# EAGLE design old_line_kick (EAGLE 7.7.0)
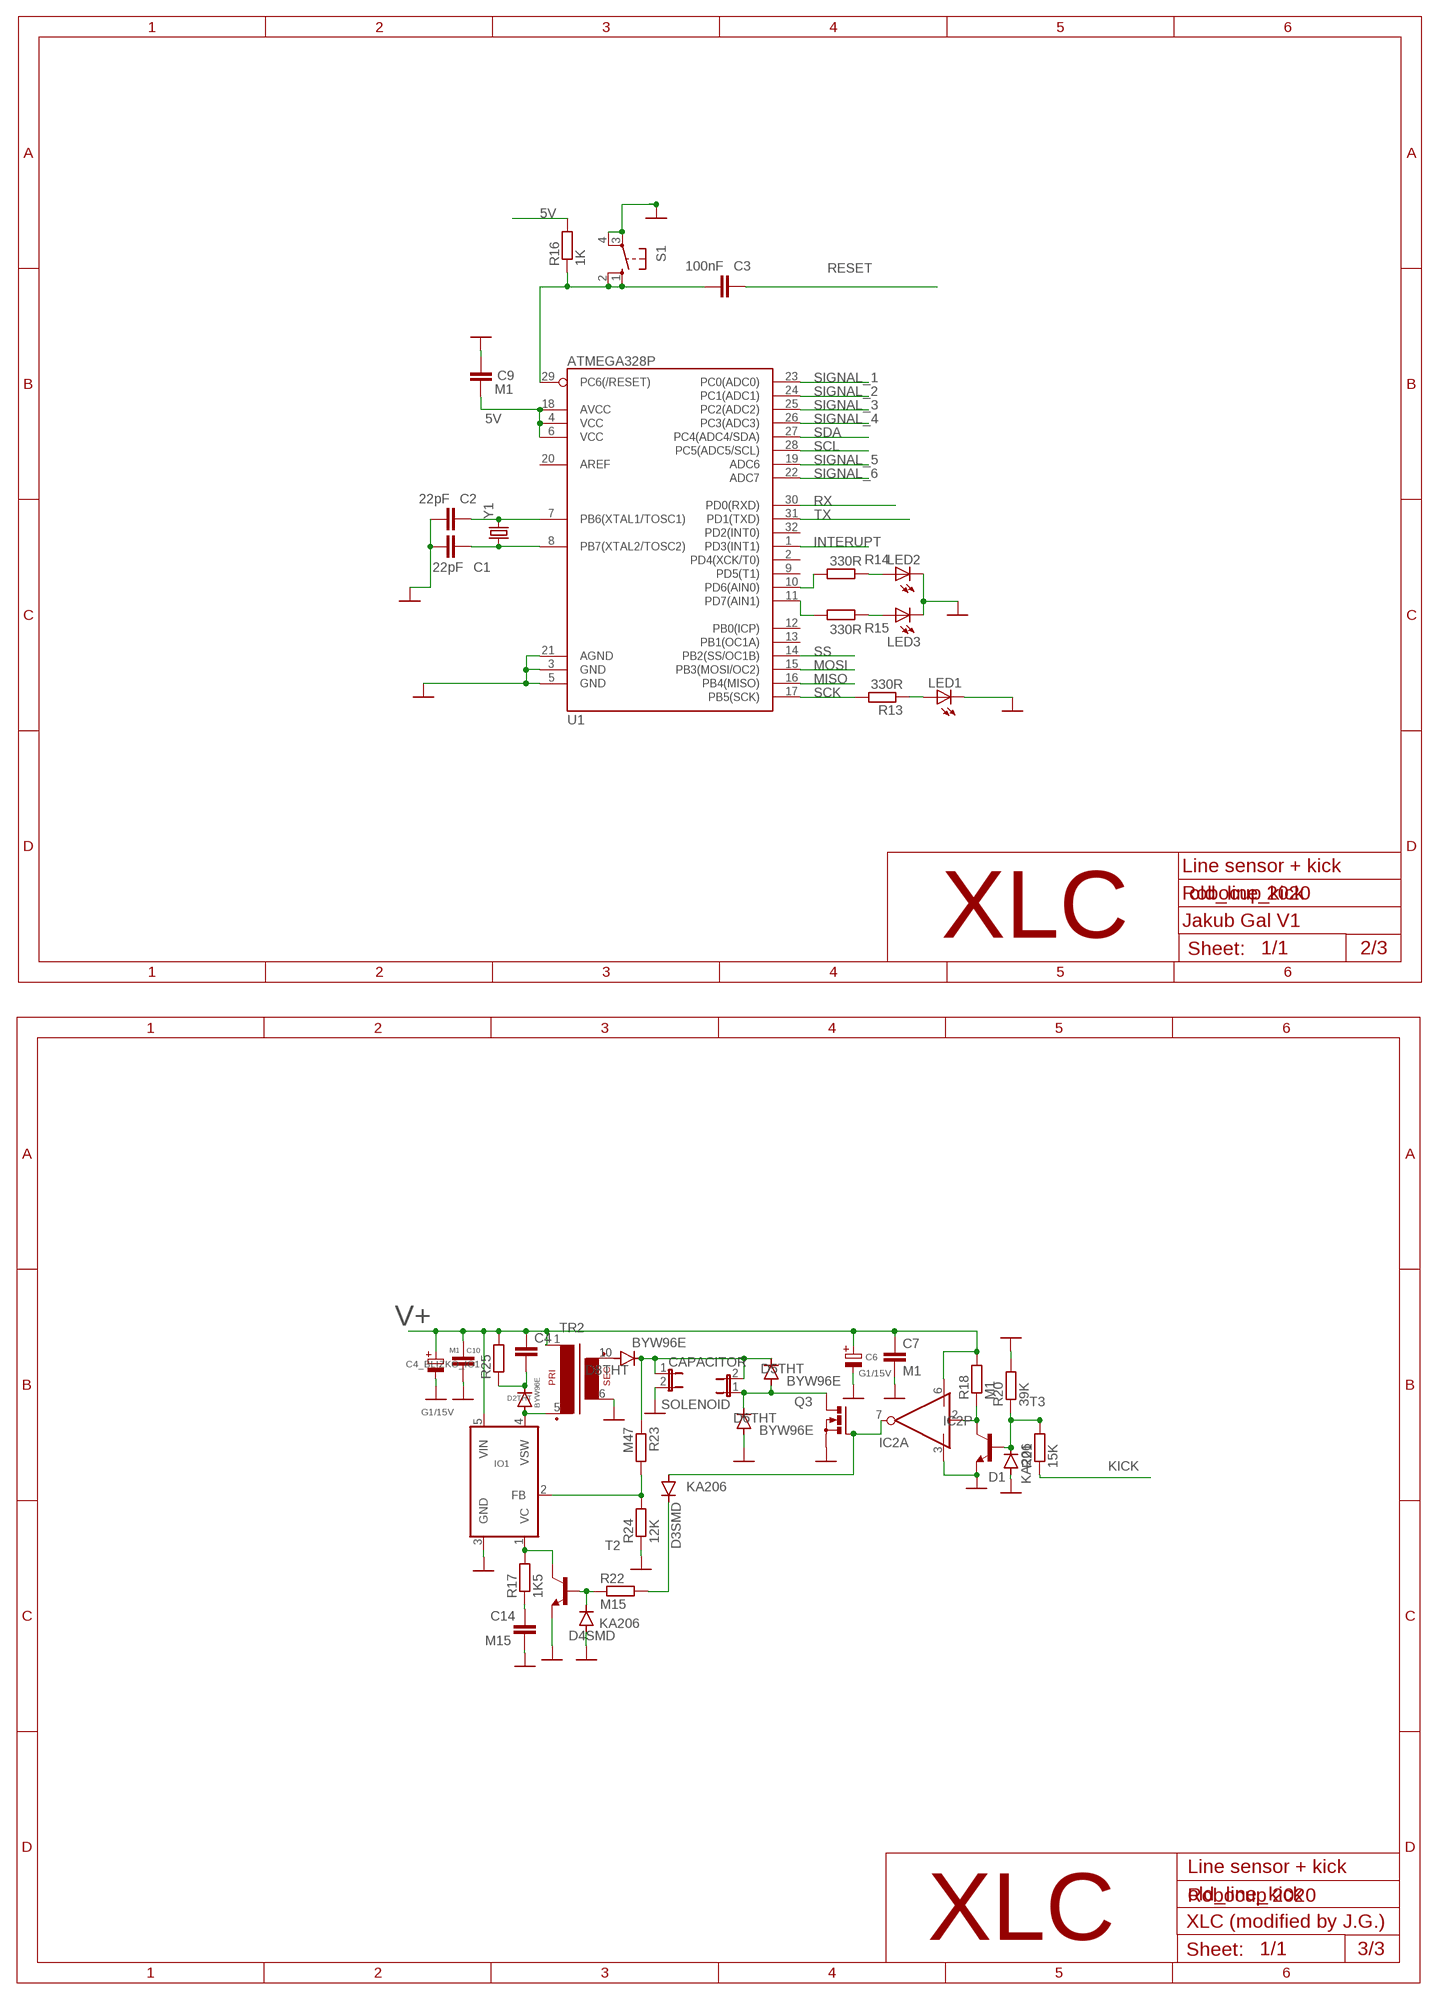
[diagram p0: schematic, sheet 1, part 1 of 2]
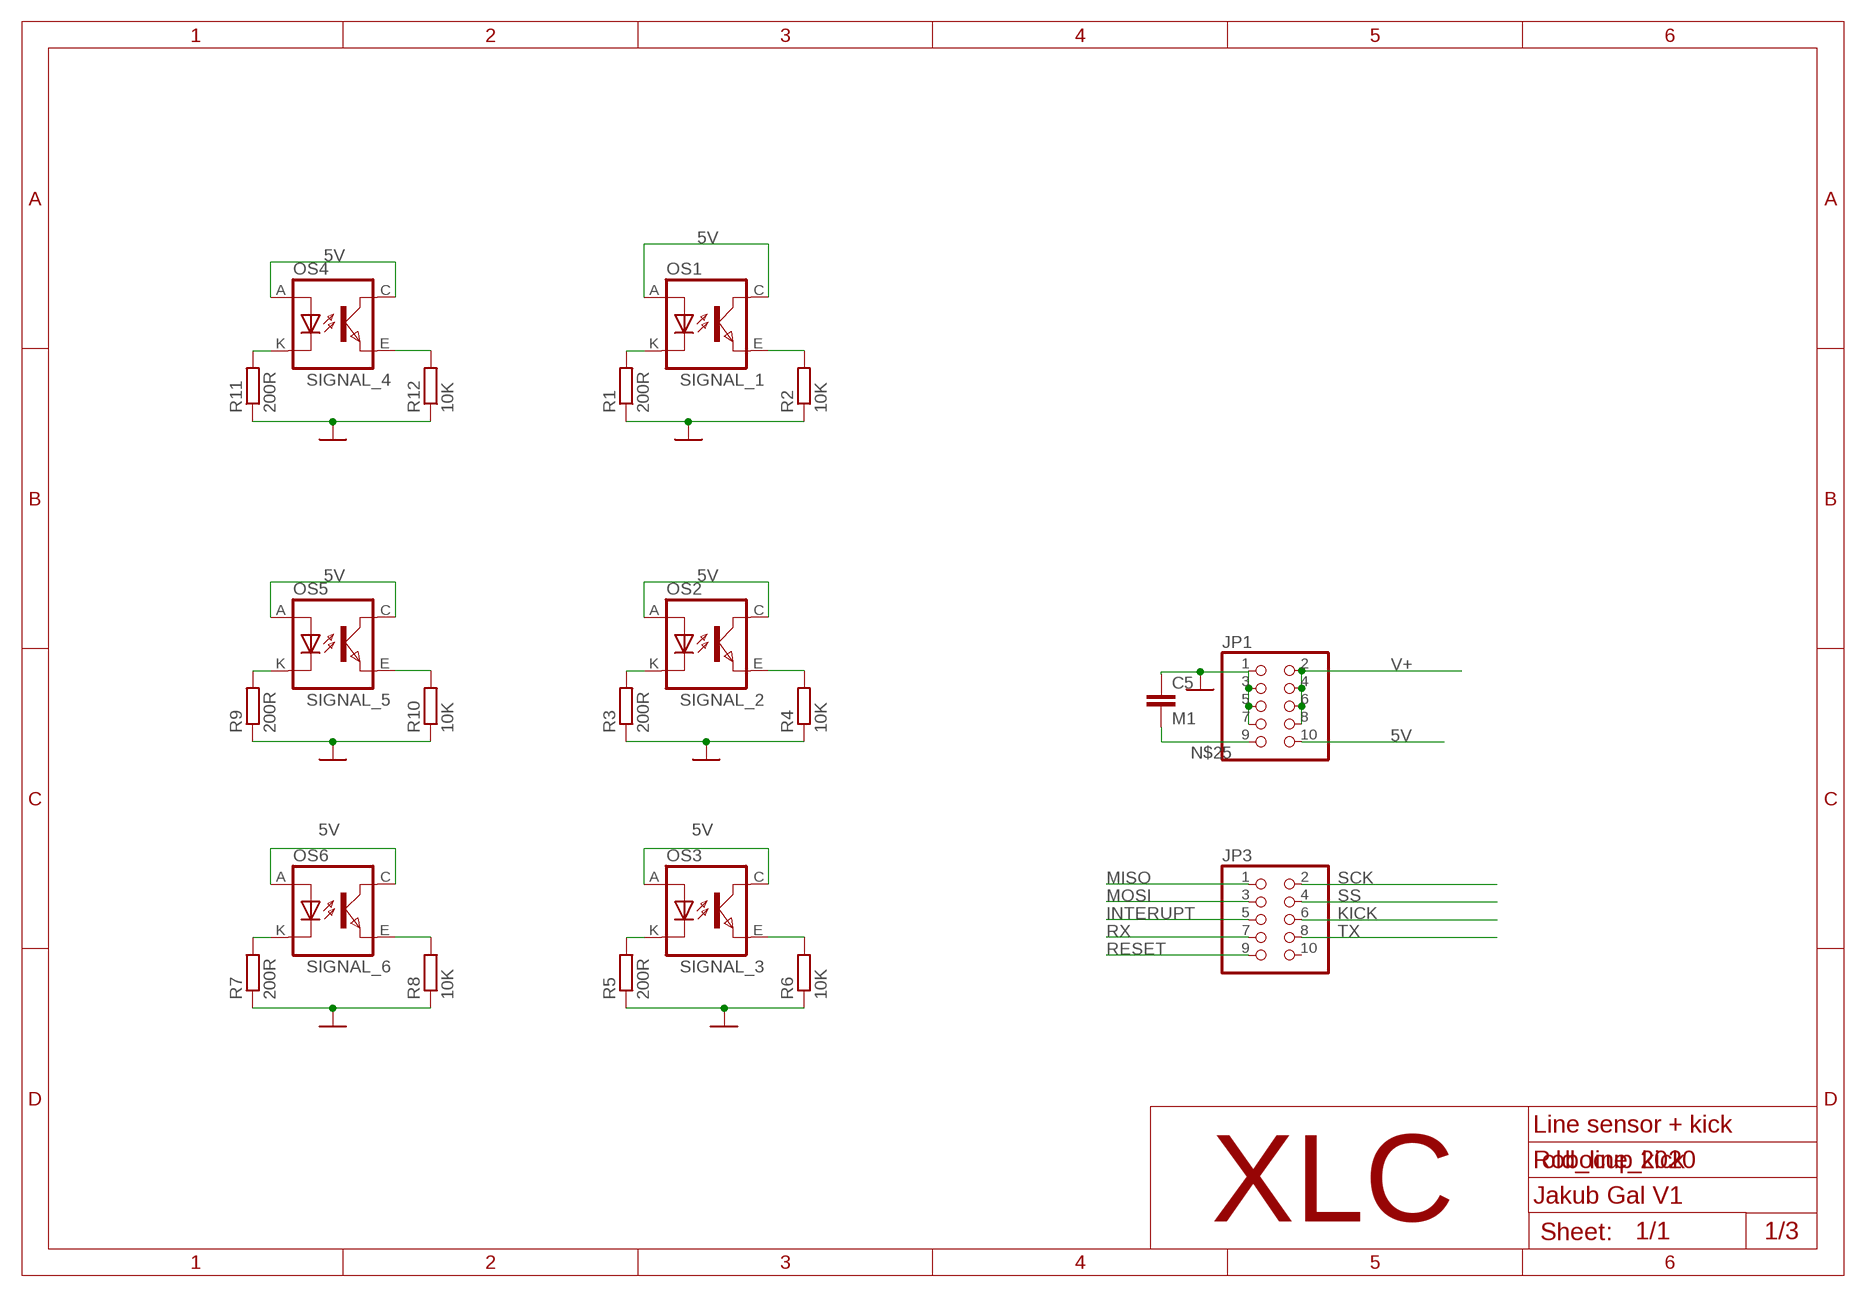
[diagram p1: schematic, sheet 1, part 2 of 2]

## Parts
C1  22pF  C-EUC0603  [C0603]
C2  22pF  C-EUC0603  [C0603]
C3  100nF  C-EUC0603  [C0603]
C4  C-EU075-052X106  [C075-052X106]
C4_BLIZKO_IO1  G1/15V  KOND-ELEKT-2,5/7  [E-2,5/7-RAD]
C5  M1  C-EUC0603  [C0603]
C6  G1/15V  KOND-ELEKT-2,5/7  [E-2,5/7-RAD]
C7  M1  C-EUC0805K  [C0805K]
C9  M1  C-EUC0603  [C0603]
C10  M1  C-EUC0805K  [C0805K]
C14  M15  C-EUC0805K  [C0805K]
CAPACITOR  JP1E  [JP1]
D1  KA206  DIODE-D-7.5  [D-7.5]
D2THT  BYW96E  BYW96  [SOD64-10]
D3SMD  KA206  DIODE-D-7.5  [D-7.5]
D4SMD  KA206  DIODE-D-7.5  [D-7.5]
D5THT  BYW96E  BYW96  [SOD64-10]
D6THT  BYW96E  BYW96  [SOD64-10]
D8THT  BYW96E  BYW96  [SOD64-10]
IC2  MIC4423BM  [SO08]
IO1  LT1071V  [TO220-5P]
JP1  PINHD-2X5IDC  [2X05_IDC]
JP3  PINHD-2X5IDC  [2X05_IDC]
LED1  LEDCHIPLED_0603  [CHIPLED_0603]
LED2  LEDCHIPLED_0603  [CHIPLED_0603]
LED3  LEDCHIPLED_0603  [CHIPLED_0603]
OS1  TCRT5000  [TCRT5000]
OS2  TCRT5000  [TCRT5000]
OS3  TCRT5000  [TCRT5000]
OS4  TCRT5000  [TCRT5000]
OS5  TCRT5000  [TCRT5000]
OS6  TCRT5000  [TCRT5000]
Q3  PMOSFET_NTO220BV  [TO220BV]
R1  200R  R-EU_R0603  [R0603]
R2  10K  R-EU_R0603  [R0603]
R3  200R  R-EU_R0603  [R0603]
R4  10K  R-EU_R0603  [R0603]
R5  200R  R-EU_R0603  [R0603]
R6  10K  R-EU_R0603  [R0603]
R7  200R  R-EU_R0603  [R0603]
R8  10K  R-EU_R0603  [R0603]
R9  200R  R-EU_R0603  [R0603]
R10  10K  R-EU_R0603  [R0603]
R11  200R  R-EU_R0603  [R0603]
R12  10K  R-EU_R0603  [R0603]
R13  330R  R-EU_R0603  [R0603]
R14  330R  R-EU_R0603  [R0603]
R15  330R  R-EU_R0603  [R0603]
R16  1K  R-EU_R0603  [R0603]
R17  1K5  R-EU_R1206  [R1206]
R18  M1  R-EU_R1206  [R1206]
R20  39K  R-EU_R1206  [R1206]
R21  15K  R-EU_R1206  [R1206]
R22  M15  R-EU_R1206  [R1206]
R23  M47  R-EU_R1206  [R1206]
R24  12K  R-EU_R1206  [R1206]
R25  REZISTOR-7,5MM-HORIZ  [R-7,5H]
S1  10-XX  [B3F-10XX]
SOLENOID  JP1E  [JP1]
T2  -NPN-SC59-BEC  [SC59-BEC]
T3  -NPN-SC59-BEC  [SC59-BEC]
TR2  TRAFO-E10-R""  [TRAFO-EE17X20]
U1  ATMEGA328P  ATMEGA328_SMT  [TQFP32-08]
Y1  CRYSTALHC49US  [HC49US]

## Nets
5V: C9.1 JP1.10 OS1.A(ANODE) OS1.C(COLLECTOR) OS2.A(ANODE) OS2.C(COLLECTOR) OS3.A(ANODE) OS3.C(COLLECTOR) OS4.A(ANODE) OS4.C(COLLECTOR) OS5.A(ANODE) OS5.C(COLLECTOR) OS6.A(ANODE) OS6.C(COLLECTOR) R16.2 U1.4(VCC) U1.6(VCC) U1.18(AVCC)
GND: C1.1 C2.1 C4_BLIZKO_IO1.- C5.1 C6.- C7.2 C9.2 C10.2 C14.2 CAPACITOR.2 D1.A D4SMD.A D6THT.A IC2.3(P:GND) IO1.3(GND) JP1.1 JP1.3 JP1.5 JP1.7 LED1.C LED2.C LED3.C Q3.S R1.1 R2.1 R3.1 R4.1 R5.1 R6.1 R7.1 R8.1 R9.1 R10.1 R11.1 R12.1 R20.2 R24.1 S1.3(P) S1.4(P1) T2.E T3.E TR2.6 U1.3(GND) U1.5(GND) U1.21(AGND)
INTERUPT: JP3.5 U1.1(PD3(INT1))
KICK: JP3.6 R21.1
MISO: JP3.1 U1.16(PB4(MISO))
MOSI: JP3.3 U1.15(PB3(MOSI/OC2))
N$1: OS1.K(CATHODE) R1.2
N$2: OS2.K(CATHODE) R3.2
N$3: OS3.K(CATHODE) R5.2
N$4: OS6.K(CATHODE) R7.2
N$5: OS5.K(CATHODE) R9.2
N$6: OS4.K(CATHODE) R11.2
N$7: C2.2 U1.7(PB6(XTAL1/TOSC1)) Y1.2
N$8: C1.2 U1.8(PB7(XTAL2/TOSC2)) Y1.1
N$9: IO1.1(VC) R17.2 T2.C
N$10: C14.1 R17.1
N$11: D8THT.A TR2.10
N$12: D3SMD.A IC2.7(A:OUT) Q3.G
N$13: CAPACITOR.1 D5THT.C D8THT.C R23.1 SOLENOID.2
N$14: IO1.2(FB) R23.2 R24.2
N$15: D4SMD.C R22.1 T2.B
N$16: C3.1 R16.1 S1.1(S) S1.2(S1) U1.29(PC6(/RESET))
N$17: LED1.A R13.1
N$18: IC2.2(A:IN) R18.1 T3.C
N$19: LED2.A R14.1
N$20: R15.2 U1.11(PD7(AIN1))
N$21: LED3.A R15.1
N$22: R14.2 U1.10(PD6(AIN0))
N$23: D2THT.A IO1.4(VSW) TR2.5
N$24: C4.2 D2THT.C R25.1
N$25: C5.2 JP1.9
N$26: D5THT.A D6THT.C Q3.D SOLENOID.1
N$29: D3SMD.C R22.2
N$31: D1.C R20.1 R21.2 T3.B
RESET: C3.2 JP3.9
RX: JP3.7 U1.30(PD0(RXD))
SCK: JP3.2 R13.2 U1.17(PB5(SCK))
SCL: U1.28(PC5(ADC5/SCL))
SDA: U1.27(PC4(ADC4/SDA))
SIGNAL_1: OS1.E(EMITTER) R2.2 U1.23(PC0(ADC0))
SIGNAL_2: OS2.E(EMITTER) R4.2 U1.24(PC1(ADC1))
SIGNAL_3: OS3.E(EMITTER) R6.2 U1.25(PC2(ADC2))
SIGNAL_4: OS4.E(EMITTER) R12.2 U1.26(PC3(ADC3))
SIGNAL_5: OS5.E(EMITTER) R10.2 U1.19(ADC6)
SIGNAL_6: OS6.E(EMITTER) R8.2 U1.22(ADC7)
SS: JP3.4 U1.14(PB2(SS/OC1B))
TX: JP3.8 U1.31(PD1(TXD))
V+: C4.1 C4_BLIZKO_IO1.+ C6.+ C7.1 C10.1 IC2.6(P:V+) IO1.5(VIN) JP1.2 JP1.4 JP1.6 JP1.8 R18.2 R25.2 TR2.1
Unconnected: IC2.4(B:IN) IC2.5(B:OUT) JP3.10 U1.2(PD4(XCK/T0)) U1.9(PD5(T1)) U1.12(PB0(ICP)) U1.13(PB1(OC1A)) U1.20(AREF) U1.32(PD2(INT0))

## Notes on the sheet
- Line sensor + kick
- Robocup 2020
- Jakub Gal V1
- XLC
- 2/3
- Line sensor + kick
- Robocup 2020
- XLC (modified by J.G.)
- XLC
- 3/3
- Line sensor + kick
- Robocup 2020
- Jakub Gal V1
- XLC
- 1/3

## Library data of the parts
C1-C3 C9 = rcl@1:C-EU: CAPACITOR, European symbol
C4 C5 = rcl:C-EU: CAPACITOR, European symbol; SPICEPREFIX: C
C4_BLIZKO_IO1 C6 = TABOR K1:KOND-ELEKT: Kondenzátor elektrolyticky
C7 C10 C14 = resistor:C-EU: CAPACITOR, European symbol
CAPACITOR SOLENOID = jumper:JP1E: JUMPER
D1 D3SMD D4SMD = diode:DIODE-: DIODE
D2THT D5THT D6THT D8THT = diode:BYW96: DIODE fast soft-recovery rectifier
IC2 = TABOR K1:MIC4423B: 2x Invertor driver MOSFET
IO1 = TABOR K1:LT1071: DC/DC pulzny IO
JP1 JP3 = pinhead-1:PINHD-2X5: PIN HEADER
LED1-LED3 = audio amplifier example:LED
OS1-OS3 OS5 = tcrt5000:TCRT5000
OS4 OS6 = tcrt5000:TCRT5000; SPICEPREFIX: O
Q3 = transistor-power:PMOSFET_N: Power MOSFET N-Channel
R1-R18 R20-R24 = rcl:R-EU_: RESISTOR, European symbol; SPICEPREFIX: R
R25 = TABOR K1:REZISTOR: REZISTOR
S1 = switch-omron:10-XX: OMRON SWITCH; MPN: B3F-1000; OC_FARNELL: 176432; OC_NEWARK: 36M3542
T2 T3 = DC_LOAD_AU:*-NPN-: NPN Transistror BF959 corrected 2008.03.06
TR2 = TABOR K1:TRAFO-E10-R: Transformátor s feritovym jadrom EE17x20: 1x primár, 1x sekundár
U1 = SparkFun-DigitalIC:ATMEGA328_SMT: 32-Pin Atmega328 part Commonly used on Arduino compatible boards Available in QFP and QFN packages TQFP is IC-09069 QFN is non-stock; PROD_ID: IC-09069
Y1 = SparkFun-FreqCtrl:CRYSTAL: Various standard crystals. Proven footprints. Spark Fun Electronics SKU : COM-00534

## Board
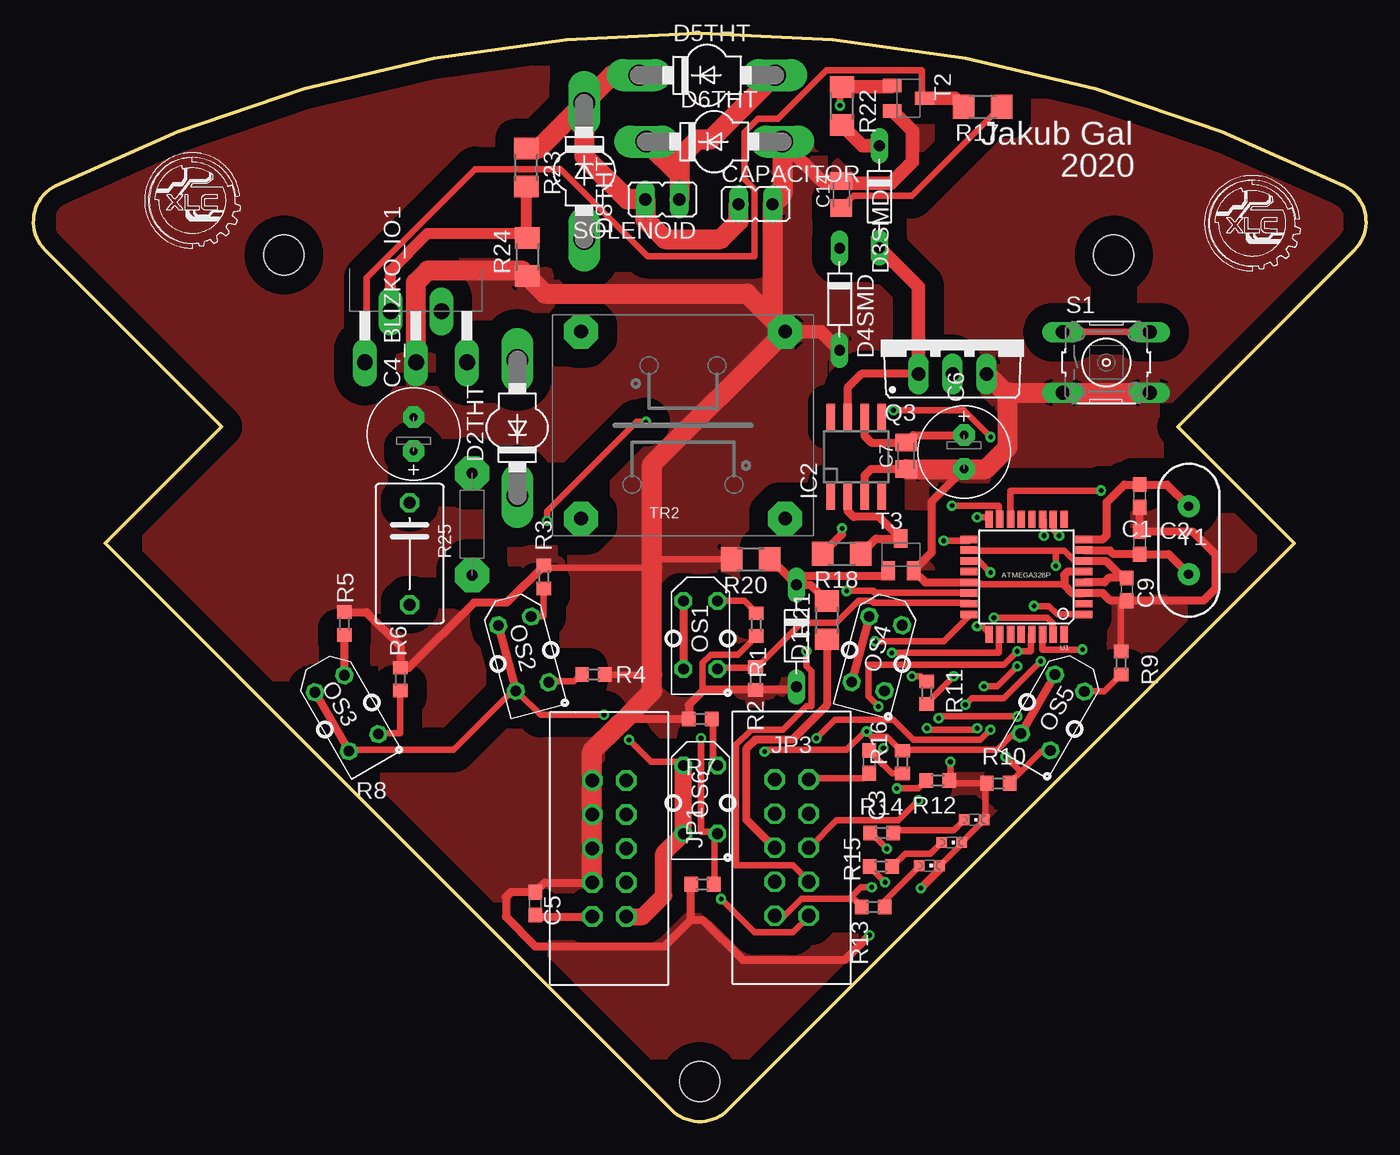
[diagram p2: board, top side]
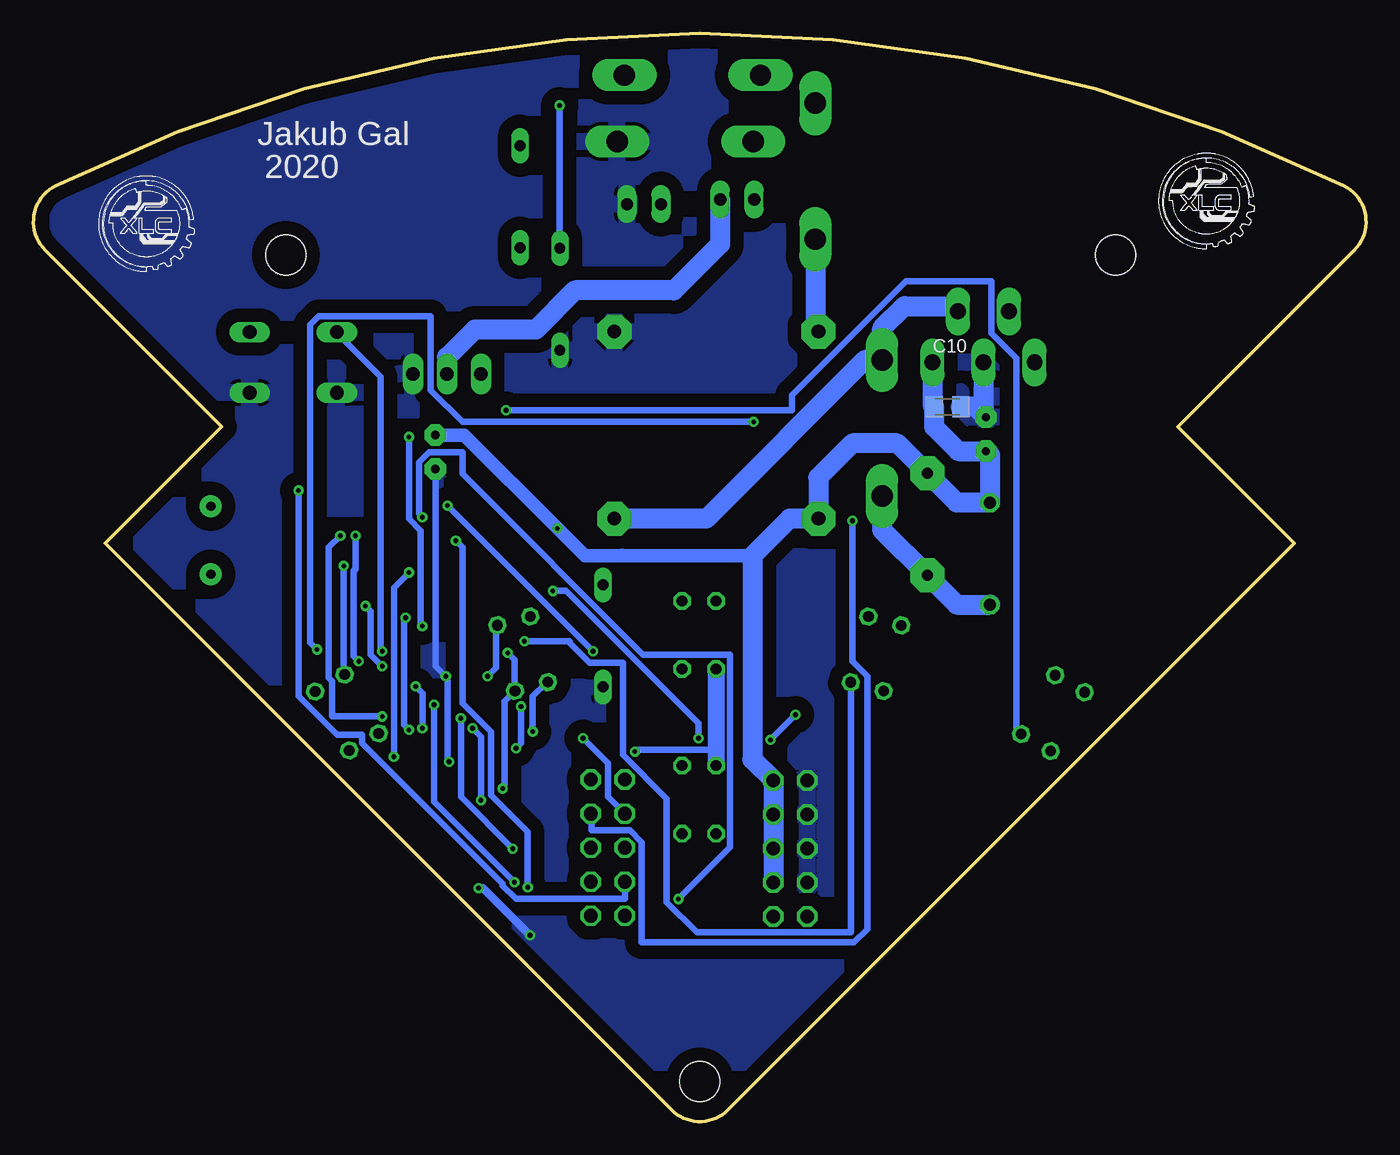
[diagram p3: board, bottom side, seen from below]

Size 99.55 x 81.25 mm. Coordinates in mm from the lower left corner, seen from the top.
Outline: 85.49,51.89 98.67,65.08 arc108 97.9,69.88 arc53 1.66,69.88 arc108 0.88,65.08 14.07,51.89 5.35,43.18 47.66,0.87 arc90 51.9,0.87 94.2,43.18 85.49,51.89
Copper layers (1*16): Top 0.035mm / dielectric 1.5mm / Bottom 0.035mm
Design rules "default *": minimum track width 0.5mm, minimum drill 0.35mm, track to track 6mil, track to pad 6mil, pad to pad 6mil, via to via 6mil, smd to smd 6mil, copper to edge 40mil, drill to drill 6mil, minimum pad ring 10mil, minimum via ring 8mil, stop-mask expansion 4mil, vias tented up to drill 0mil, thermal gap 10mil
Holes 3 mm at 49.78,3 18.71,64.71 80.71,64.71

### Footprints (pad centres in the part's own frame; a part is rotated, then mirrored left to right if it is on the bottom)
C0603 = smd 1.1 x 1: 1 -0.85,0; 2 0.85,0
C075-052X106 = drill 0.914 octagon: 1 -3.81,0; 2 3.81,0
E-2,5/7-RAD = drill 0.61 pad 1.6 octagon: + -1.27,0; - 1.27,0
C0805K = smd 1.3 x 1.6: 1 -1,0; 2 1,0
JP1 = drill 0.914 long: 1 0,-1.27; 2 0,1.27
D-7.5 = drill 0.813 long: A 3.81,0; C -3.81,0
SOD64-10 = drill 1.6 long: A 5.08,0; C -5.08,0
SO08 = smd 0.61 x 1.981: 1 -1.905,-2.972; 2 -0.635,-2.972; 3 0.635,-2.972; 4 1.905,-2.972; 5 1.905,2.972; 6 0.635,2.972; 7 -0.635,2.972; 8 -1.905,2.972
TO220-5P = drill 1.194 pad 1.676 long: 1 -3.81,0; 2 -1.905,3.81; 3 0,0; 4 1.905,3.81; 5 3.81,0
2X05_IDC = drill 1.016 octagon: 1 -5.08,-1.27; 2 -5.08,1.27; 3 -2.54,-1.27; 4 -2.54,1.27; 5 0,-1.27; 6 0,1.27; 7 2.54,-1.27; 8 2.54,1.27; 9 5.08,-1.27; 10 5.08,1.27
CHIPLED_0603 = smd 0.8 x 0.8: A 0,-0.75; C 0,0.75
TCRT5000 = drill 0.8 octagon: A -2.54,-1.27; C 2.54,-1.27; E 2.54,1.27; K -2.54,1.27
TO220BV = drill 1.016 long: D 0,-2.54; G -2.54,-2.54; S 2.54,-2.54
R0603 = smd 1 x 1.1: 1 -0.85,0; 2 0.85,0
R1206 = smd 1.6 x 1.803: 1 -1.422,0; 2 1.422,0
R-7,5H = drill 0.813 pad 2.54 octagon: 1 -3.81,0; 2 3.81,0
B3F-10XX = drill 1.016 long: 1 -3.251,2.261; 2 3.251,2.261; 3 -3.251,-2.261; 4 3.251,-2.261
SC59-BEC = smd 1 x 1.4: B -0.95,-1.2; C 0,1.2; E 0.95,-1.2
TRAFO-EE17X20 = drill 1.016 pad 2.54 octagon: 1 -7.62,-7.62; 5 7.62,-7.62; 6 7.62,6.35; 10 -7.62,6.35
TQFP32-08 = smd 1.27 x 0.559: 1 -4.293,2.8; 2 -4.293,2; 3 -4.293,1.2; 4 -4.293,0.4; 5 -4.293,-0.4; 6 -4.293,-1.2; 7 -4.293,-2; 8 -4.293,-2.8; 17 4.293,-2.8; 18 4.293,-2; 19 4.293,-1.2; 20 4.293,-0.4; 21 4.293,0.4; 22 4.293,1.2; 23 4.293,2; 24 4.293,2.8 | smd 0.559 x 1.27: 9 -2.8,-4.293; 10 -2,-4.293; 11 -1.2,-4.293; 12 -0.4,-4.293; 13 0.4,-4.293; 14 1.2,-4.293; 15 2,-4.293; 16 2.8,-4.293; 25 2.8,4.293; 26 2,4.293; 27 1.2,4.293; 28 0.4,4.293; 29 -0.4,4.293; 30 -1.2,4.293; 31 -2,4.293; 32 -2.8,4.293
HC49US = drill 0.7 pad 1.651: 1 -2.54,0; 2 2.54,0

### Placement (x,y rotation side)
C1  82.63,46.72 90 top
C2  82.63,43.22 270 top
C3  62.44,26.86 270 top
C4  28.1,42.41 270 top
C4_BLIZKO_IO1  28.4,51.34 90 top
C5  37.48,16.28 270 top
C6  69.53,50 270 top
C7  65.19,49.72 270 top
C9  81.68,39.75 270 top
C10  31.27,53.38 0 bottom
C14  60.36,69.23 90 top
CAPACITOR  53.95,68.51 270 top
D1  57.01,36.27 270 top
D2THT  36.15,51.8 90 top
D3SMD  63.2,69.07 270 top
D4SMD  60.23,61.41 270 top
D5THT  50.32,78.14 0 top
D6THT  50.86,73.19 0 top
D8THT  41.14,70.97 270 top
IC2  61.46,49.66 0 top
IO1  28.57,56.69 0 top
JP1  43.01,20.39 270 top
JP3  56.64,20.45 90 top
LED1  66.93,19.11 270 top
LED2  70.28,22.54 270 top
LED3  68.6,20.84 270 top
OS1  49.83,36.34 270 top
OS2  36.61,34.93 285 top
OS3  23.4,30.5 300 top
OS4  63.01,34.94 255 top
OS5  76.13,30.54 240 top
OS6  49.83,24.04 270 top
Q3  68.66,58.37 0 top
R1  54,37.11 90 top
R2  53.94,33.09 90 top
R3  38.13,40.67 270 top
R4  41.83,33.38 180 top
R5  23.23,37.19 270 top
R6  27.42,33.04 270 top
R7  49.82,30.06 0 top
R8  49.98,17.72 0 top
R9  81.25,34.24 270 top
R10  72.08,25.26 0 top
R11  66.74,32.02 90 top
R12  67.55,25.47 180 top
R13  62.73,16.02 180 top
R14  63.37,21.54 180 top
R15  63.31,19.04 180 top
R16  64.92,26.84 90 top
R17  70.91,75.78 180 top
R18  60.38,42.4 180 top
R20  53.58,41.99 180 top
R21  59.27,37.44 90 top
R22  60.4,75.84 270 top
R23  36.82,71.24 270 top
R24  36.89,64.57 90 top
R25  32.77,44.6 90 top
S1  80.15,56.69 0 top
SOLENOID  46.98,68.86 90 top
T2  65.36,76.42 270 top
T3  64.8,42.34 0 top
TR2  48.53,52.65 0 top
U1  74.19,40.67 180 top
Y1  86.31,43.41 270 top

### Tracks (layer width: path | path; a pad name or v marks a point on that pad's centre or on a via)
5V  (via drill 0.35)
  Top 0.5: OS3.C 23.75,27.75 31.37,27.75 35.75,32.12 OS2.C 36.25,32 37.87,30.37 v42.62,30.37 | v44.5,28.5 46.12,26.87 48,26.87 OS6.A | 76.37,42.62 77,42.62 77.75,41.87 78.25,41.87 U1.6 | 76.37,42.62 70,42.62 U1.18 | OS5.C 73.5,28.87 73.12,28.87 72,27.75 65,27.75 R16.2 64.75,27.75 63.75,28.75 62.62,28.75 v62.25,29.12 62.12,29 62,29 60.75,27.75 54.75,27.75 v54.62,27.62 | v76.37,41.5 76.37,42.62
  Top 0.61: U1.4 80.01,40.27 80.34,40.6 C9.1 81.38,40.6 80.11,41.87 U1.6 | OS3.A OS3.C | OS2.A OS2.C | OS1.A OS1.C | OS4.A OS4.C | OS5.A OS5.C
  Top 1.27: JP1.10 45.51,15.31 47.08,16.88 47.08,20.02 OS6.C OS6.A
  Bottom 0.5: v44.5,28.5 v42.62,30.37 | v76.37,41.5 76.37,33.5 OS5.A | v62.25,29.12 62.25,31.75 61.25,32.75 OS4.C | 48.56,27.75 54.62,27.75 v54.62,27.62
  Bottom 1.27: OS1.C 48.56,27.75 OS6.A
GND  (via drill 0.35)
  Top 0.5: LED1.C 67.75,19.12 69.37,20.75 LED3.C 69.5,21 71,22.5 LED2.C 71.12,22.75 71.12,25.25 R10.1 70.87,25.25 68.62,25.25 68.5,25.37 R12.1 68.5,25.62 v68.5,26.87 | R9.1 81.25,38.62 C9.2 | 46.22,33.37 42.75,33.37 R4.1 | R1.1 52.62,34.87 50.62,34.87 50,34.25 50,32.5 50.09,32.24 | v68.75,33.25 66.75,31.25 R11.1 | 46.22,42 52.12,42 R20.2 | 77,40.06 76.75,40.12 70.75,40.12 70.62,40.25 70.12,40.25 U1.21 | 46.22,41.37 38.37,41.37 R3.1
  Top 0.61: C7.2 62.58,48.72 62.09,48.23 IC2.3 | D1.A 56.79,32.24 R2.1 50.09,32.24 48.97,31.12 R7.1 44.14,30.06 43.73,29.65 | C6.- 67.12,46.32 67.12,42.51 T3.E 66.62,40.27 U1.21 | U1.5 77.25,41.07 77,40.82 77,40.06 77.59,39.47 U1.3 79.9,39.47 80.47,38.9 C9.2 87.41,38.9 88.29,39.78 88.29,42.35 86.57,44.07 C2.1 C1.1 | R5.1 24.87,38.04 27.42,35.49 R6.1 28.04,33.89 32.9,38.75 35.36,38.75 R3.1 | JP1.7 38.2,17.85 C5.1 36.12,17.13 35.65,17.13 35.29,16.77 35.29,15.29 37.49,13.09 47.16,13.09 49.13,15.06 | 49.13,15.06 R8.1 | 49.13,15.06 50,15.06 52.99,12.07 60.61,12.07 v62.45,13.91 | v66.3,17.43 67.75,18.88 67.75,19.12
  Top 0.813: 28.52,56.74 IO1.3
  Top 1.016: TR2.6 58.83,59 D4SMD.A | T2.E 65.65,73.98 65.65,71.68 64.05,70.08 60.51,70.08 C14.2 58.9,70.23 D6THT.A
  Top 1.5: JP1.7 JP1.5 JP1.3 JP1.1 41.74,27.66 43.73,29.65 46.22,32.14 46.22,33.37 46.22,41.37 46.22,42 46.22,49.07 TR2.6 | TR2.6 53.32,61.83 38.21,61.83 R24.1 36.49,63.54 29.45,63.54 28.56,62.65 28.56,56.77 28.52,56.74 | TR2.6 55.22,59.93 CAPACITOR.2 55.94,69.23 D6THT.A | C7.2 C6.- 71.15,48.73 72.79,50.37 72.79,54.24 | 72.79,54.24 Q3.S | 72.79,54.24 72.98,54.43 S1.3 S1.4
  Bottom 0.5: C6.- 69.5,48.62 69.5,34 v68.75,33.25 68.62,33.12 68.62,27 v68.5,26.87
  Bottom 0.61: v62.45,13.91 65.97,17.43 v66.3,17.43
  Bottom 1.5: IO1.3 28.57,52.78 C4_BLIZKO_IO1.- 29.17,53.38 C10.2
  pour Bottom (isolate 1): -9,-8.79 108,-8.79 108,83.3 -9,83.3
  pour Top (isolate 1.422): -10,80 -10,-10 110,-10 110,80 110,90 -10,90
INTERUPT  (via drill 0.35)
  Top 0.5: v74.75,38.5 75.87,38.5 76.5,37.87 78.37,37.87 U1.1 | v73.5,34 72,32.5 v71,32.5 | v70.5,29.37 70.37,29.25 66.87,29.25 v66.75,29.37 | v66.12,24 64.62,22.5 60,22.5 58,20.5 JP3.5
  Bottom 0.5: v74.75,38.5 74.37,38.12 74.37,34.87 v73.5,34 | v71,32.5 70.5,32 v70.5,29.37 | v66.75,29.37 66.12,28.75 v66.12,24
KICK
  Top 0.61: R21.1 59.27,31.09 56.7,28.52 53.94,28.52 53.25,27.83 53.25,22.57 JP3.6
MISO  (via drill 0.35)
  Top 0.5: v70.5,45.12 71.25,45.12 71.37,45 U1.16 | v51.37,16.62 53.87,14.12 56.75,14.12 57.87,15.25 JP3.1
  Bottom 0.5: v70.5,45.12 70.75,45.37 70.75,49.25 70,50 67.5,50 67.5,48.37 54,34.87 47.5,34.87 47.5,20.5 v51.37,16.62
MOSI  (via drill 0.35)
  Top 0.5: v68.62,46 72.12,46 72.12,45 U1.15 | v57.75,35.12 57.75,34 58.12,33.62 58.12,31 57.75,31 56,29.25 53.62,29.25 52.5,28.12 52.5,19.12 56.75,19.12 57.87,18 JP3.3
  Bottom 0.5: v57.75,35.12 v68.62,46
N$1
  Top 0.5: R1.2 54,38 53.12,38.87 51.12,38.87 OS1.K
N$2
  Top 0.5: R3.2 38.12,39.75 38.12,37.75 37.25,37.75 OS2.K
N$3
  Top 0.61: OS3.K R5.2 | R5.2
N$4
  Top 0.5: R7.2 50.75,30 50.75,26.62 51,26.62 OS6.K
N$5
  Top 0.5: R9.2 81.25,33.37 80,32.12 78.62,32.12 OS5.K
N$6  (via drill 0.35)
  Top 0.5: v65.62,33.25 66.25,33.25 66.62,32.87 R11.2
  Bottom 0.5: v65.62,33.25 65,33.87 65,37 OS4.K
N$7
  Top 0.61: U1.7 78.52,42.63 80.42,42.63 80.69,42.37 C2.2 84.81,42.37 Y1.2
N$8
  Top 0.61: U1.8 79.88,43.47 80.18,43.77 80.18,46.26 81.49,47.57 C1.2 84.69,47.57 Y1.1
N$9
  Top 0.5: T2.C 66.37,76.87 66.37,78.5 59.25,78.5 55.62,74.87 54.12,74.87 53.12,73.87 53.12,70.37 53.87,69.62 53.87,64.62 45.87,64.62 39.37,71.12 33,71.12 24.87,63 24.87,56.75 IO1.1
  Top 1.016: T2.C 68.85,76.42 R17.2
N$10
  Top 0.5: C14.1 60.37,68.25 61.25,69.12 65.62,69.12 72.25,75.75 R17.1
N$11
  Bottom 1.5: D8THT.A 41.14,59.23 TR2.10
N$12
  Top 0.61: Q3.G 61.86,55.83 60.82,54.79 IC2.7
  Top 1.016: Q3.G 66.12,62.34 D3SMD.A
N$13
  Top 1.5: D8THT.C 37.75,72.66 R23.1 | D8THT.C 41.14,72.09 44.37,68.86 SOLENOID.2 45.71,67.36 47.17,65.9 51.34,65.9 52.68,67.24 CAPACITOR.1 | D8THT.C 43.23,78.14 D5THT.C
N$14
  Top 0.813: IO1.2 26.66,63.54 29.44,66.32 36.56,66.32 R24.2 36.82,66.06 R23.2
N$15  (via drill 0.35)
  Top 0.5: v60.25,75.87 60.25,76.87 R22.1
  Top 1.016: R22.1 64.05,77.26 T2.B
  Bottom 0.5: v60.25,75.87 60.25,65.25 D4SMD.C
N$16  (via drill 0.35)
  Top 0.5: 62.87,27.25 64.12,26 64.87,26 R16.1 | 62.87,27.25 62.5,27.62 C3.1 | U1.29 74.5,36.37 74.5,35.12 v73.5,35.12 72.5,34.12 62.37,34.12 62.37,31.75 v63.12,31 | v63.5,27.87 62.87,27.25 | S1.2 83.37,59 77,59 S1.1
  Bottom 0.5: v73.5,35.12 73.62,35.25 73.62,55.62 76.87,58.87 S1.1 | v63.5,27.87 63.12,28.25 v63.12,31
N$17
  Top 0.5: LED1.A 66.12,19 63.58,16.45 R13.1
N$18
  Top 0.61: IC2.2 60.82,45.59 61.26,45.15 63.18,45.15 T3.C 62.94,43.54 R18.1
N$19
  Top 0.5: LED2.A 69.5,22.5 68.75,21.75 64.37,21.75 64.25,21.62 R14.1
N$20  (via drill 0.35)
  Top 0.5: v63.62,17.87 R15.2 | v69.62,31.12 70.12,31.62 72.5,31.62 v75.25,34.37 | v75.5,43.75 75.5,44.87 U1.11
  Bottom 0.5: v63.62,17.87 69.62,23.87 v69.62,31.12 | v75.25,34.37 75.62,34.75 75.62,41.12 75.5,41.25 v75.5,43.75
N$21
  Top 0.5: LED3.A 67.75,20.75 67,20 65.12,20 64.25,19.12 R15.1
N$22  (via drill 0.35)
  Top 0.5: v63.75,20.37 62.62,21.5 R14.2 | v67.62,30.12 67.75,30.25 v73.5,30.25 | v76.62,43.75 76.25,44.12 76.25,44.87 U1.10
  Bottom 0.5: v63.75,20.37 67.62,24.25 v67.62,30.12 | v73.5,30.25 77.25,30.25 77.25,32.87 77.5,33.12 77.5,42.87 v76.62,43.75
N$23
  Bottom 1.5: IO1.4 30.87,60.9 34.48,60.9 36.15,59.23 D2THT.A 37.43,56.88 49.28,45.03 TR2.5
N$24
  Bottom 1.5: D2THT.C 36.15,44.17 R25.1 30.58,38.6 C4.2
N$25
  Top 0.61: C5.2 37.6,15.31 JP1.9
N$26
  Top 1.5: D5THT.A 50.59,73.33 49.62,73.33 48.25,71.96 SOLENOID.1 48.25,70.72 D6THT.C
  Bottom 1.5: SOLENOID.1 48.25,65.53 51.71,62.07 59.1,62.07 62.02,59.15 66.59,59.15 68.66,57.08 Q3.D
N$29
  Top 1.016: R22.2 61.94,72.88 D3SMD.C
N$31
  Top 0.61: D1.C 57.66,40.73 63.44,40.73 T3.B | D1.C 58.05,40.08 R21.2 | R20.1 55.1,41.99 D1.C
RESET
  Top 0.5: C3.2 62.37,26 62,25.62 58,25.62 JP3.9
RX  (via drill 0.35)
  Top 0.5: v78.37,35.25 75.37,35.25 75.37,36.37 U1.30 | v45.75,52.25 45.05,52.25 38.37,45.57 v38.37,44.87
  Bottom 0.5: v78.37,35.25 78.87,35.75 78.87,59.5 78.25,60.12 69.87,60.12 69.87,54.62 67.5,52.25 v45.75,52.25 | v38.37,44.87 38.37,34.37 37.25,33.25 37.25,14.37 38.25,13.37 54.12,13.37 54.12,20.87 55,21.75 57.87,21.75 57.87,22.87 JP3.7
SCK  (via drill 0.35)
  Top 0.5: JP3.2 56.12,15.37 57.37,16.62 61.3,16.62 R13.2 61.1,16.79 61.8,17.5 v62.62,17.5 | v68,43.37 69.87,43.37 U1.17
  Bottom 0.5: v68,43.37 67.5,42.87 67.5,31.25 65.37,29.12 65.37,24.37 62.62,21.62 v62.62,17.5
SIGNAL_1
  Top 0.5: OS1.E 51.12,33.87 53.87,33.87 R2.2 54.12,34 57.37,37.25 60,37.25 61.62,38.87 62.62,38.87 62.75,38.75 69.87,38.75 U1.23
SIGNAL_2  (via drill 0.35)
  Top 0.5: R4.2 40.87,33.37 40.37,32.87 38.5,32.87 OS2.E | v62.87,35.87 68,35.87 69.87,37.75 U1.24
  Bottom 0.5: v62.87,35.87 59.5,35.87 59.5,35.75 58,34.25 55.5,34.25 55.5,27.37 52.25,24.12 52.25,16.37 50,14.12 38.5,14.12 38.5,32.75 OS2.E
SIGNAL_3  (via drill 0.35)
  Top 0.5: R6.2 27.37,32.12 27.37,29 25.87,29 OS3.E | v70.5,37 70.87,37 71.37,36.5 U1.25 | v71.5,51.12 69.5,53.12 v64.25,53.12
  Bottom 0.5: v70.5,37 70.62,37.12 70.62,44.12 71.5,45 v71.5,51.12 | v64.25,53.12 42.87,53.12 42.87,54.25 34.37,62.75 28,62.75 28,58.87 26.12,57 26.12,29.25 25.87,29 OS3.E
SIGNAL_4  (via drill 0.35)
  Top 0.5: v64.5,24.87 66.12,24.87 66.62,25.37 R12.2 | v64.12,35 72.12,35 72.12,36.37 U1.26
  Bottom 0.5: v64.5,24.87 64.37,25 64.37,31.37 63.62,32.12 OS4.E 63.62,32.37 63.62,34.5 v64.12,35
SIGNAL_5  (via drill 0.35)
  Top 0.5: 73.75,26.12 75.25,27.62 75.87,27.62 OS5.E | 73.75,26.12 73,25.37 R10.2 | v71.5,41 70.62,41.87 70,41.87 U1.19 | 73.75,26.12 v72.62,27.25
  Bottom 0.5: v71.5,41 72.62,39.87 v72.62,27.25
SIGNAL_6  (via drill 0.35)
  Top 0.5: R8.2 50.87,17.75 50.87,21.5 OS6.E 50.75,21.62 49.87,21.62 v49.87,28.62 | v60.75,39.62 62.75,39.62 62.87,39.5 69.87,39.5 U1.22
  Bottom 0.5: v60.75,39.62 59.75,39.62 49.87,29.75 v49.87,28.62
SS  (via drill 0.35)
  Top 0.5: v79.75,47.12 73,47.12 73,45 U1.14
  Bottom 0.5: v79.75,47.12 79.75,31.75 76.87,28.87 75,28.87 75,28.25 64.5,17.75 64.5,17.62 63.5,16.62 55.37,16.62 55.37,17.87 JP3.4
TX  (via drill 0.35)
  Top 0.5: v71.75,37.62 75.75,37.62 76.12,37.25 76.12,36.5 U1.31 | v71.5,29.25 70.75,28.5 65.75,28.5 64.25,30 59.87,30 v58.5,28.62
  Bottom 0.5: v71.75,37.62 71.87,37.5 71.87,29.62 v71.5,29.25 | v58.5,28.62 56.62,26.75 56.62,24.25 JP3.8
V+  (via drill 0.35)
  Top 0.61: IC2.6 62.09,51.21 62.6,50.71 C7.1 65.74,51.27 C6.+ | R18.2 60.41,43.85 v60.41,44.3
  Bottom 1.016: 45.84,42.25 55.52,42.25 | 55.52,42.25 55.58,42.31 | 55.52,42.25 58.36,42.25 v60.41,44.3 67.38,51.27 C6.+
  Bottom 1.5: IO1.5 32.38,53.49 C10.1 32.27,51.87 30.47,50.07 C4_BLIZKO_IO1.+ 28.1,49.77 C4.1 30.58,46.22 R25.2 35.01,50.65 38.37,50.65 40.91,48.11 TR2.1 43.06,45.03 45.84,42.25 45.84,27.03 JP1.2 JP1.4 JP1.6 JP1.8

### Text on the board
tNames: Jakub Gal | 2020
bNames: Jakub Gal | 2020